# Altium schematic sheet [10] - Isolation.SchDoc
size A3
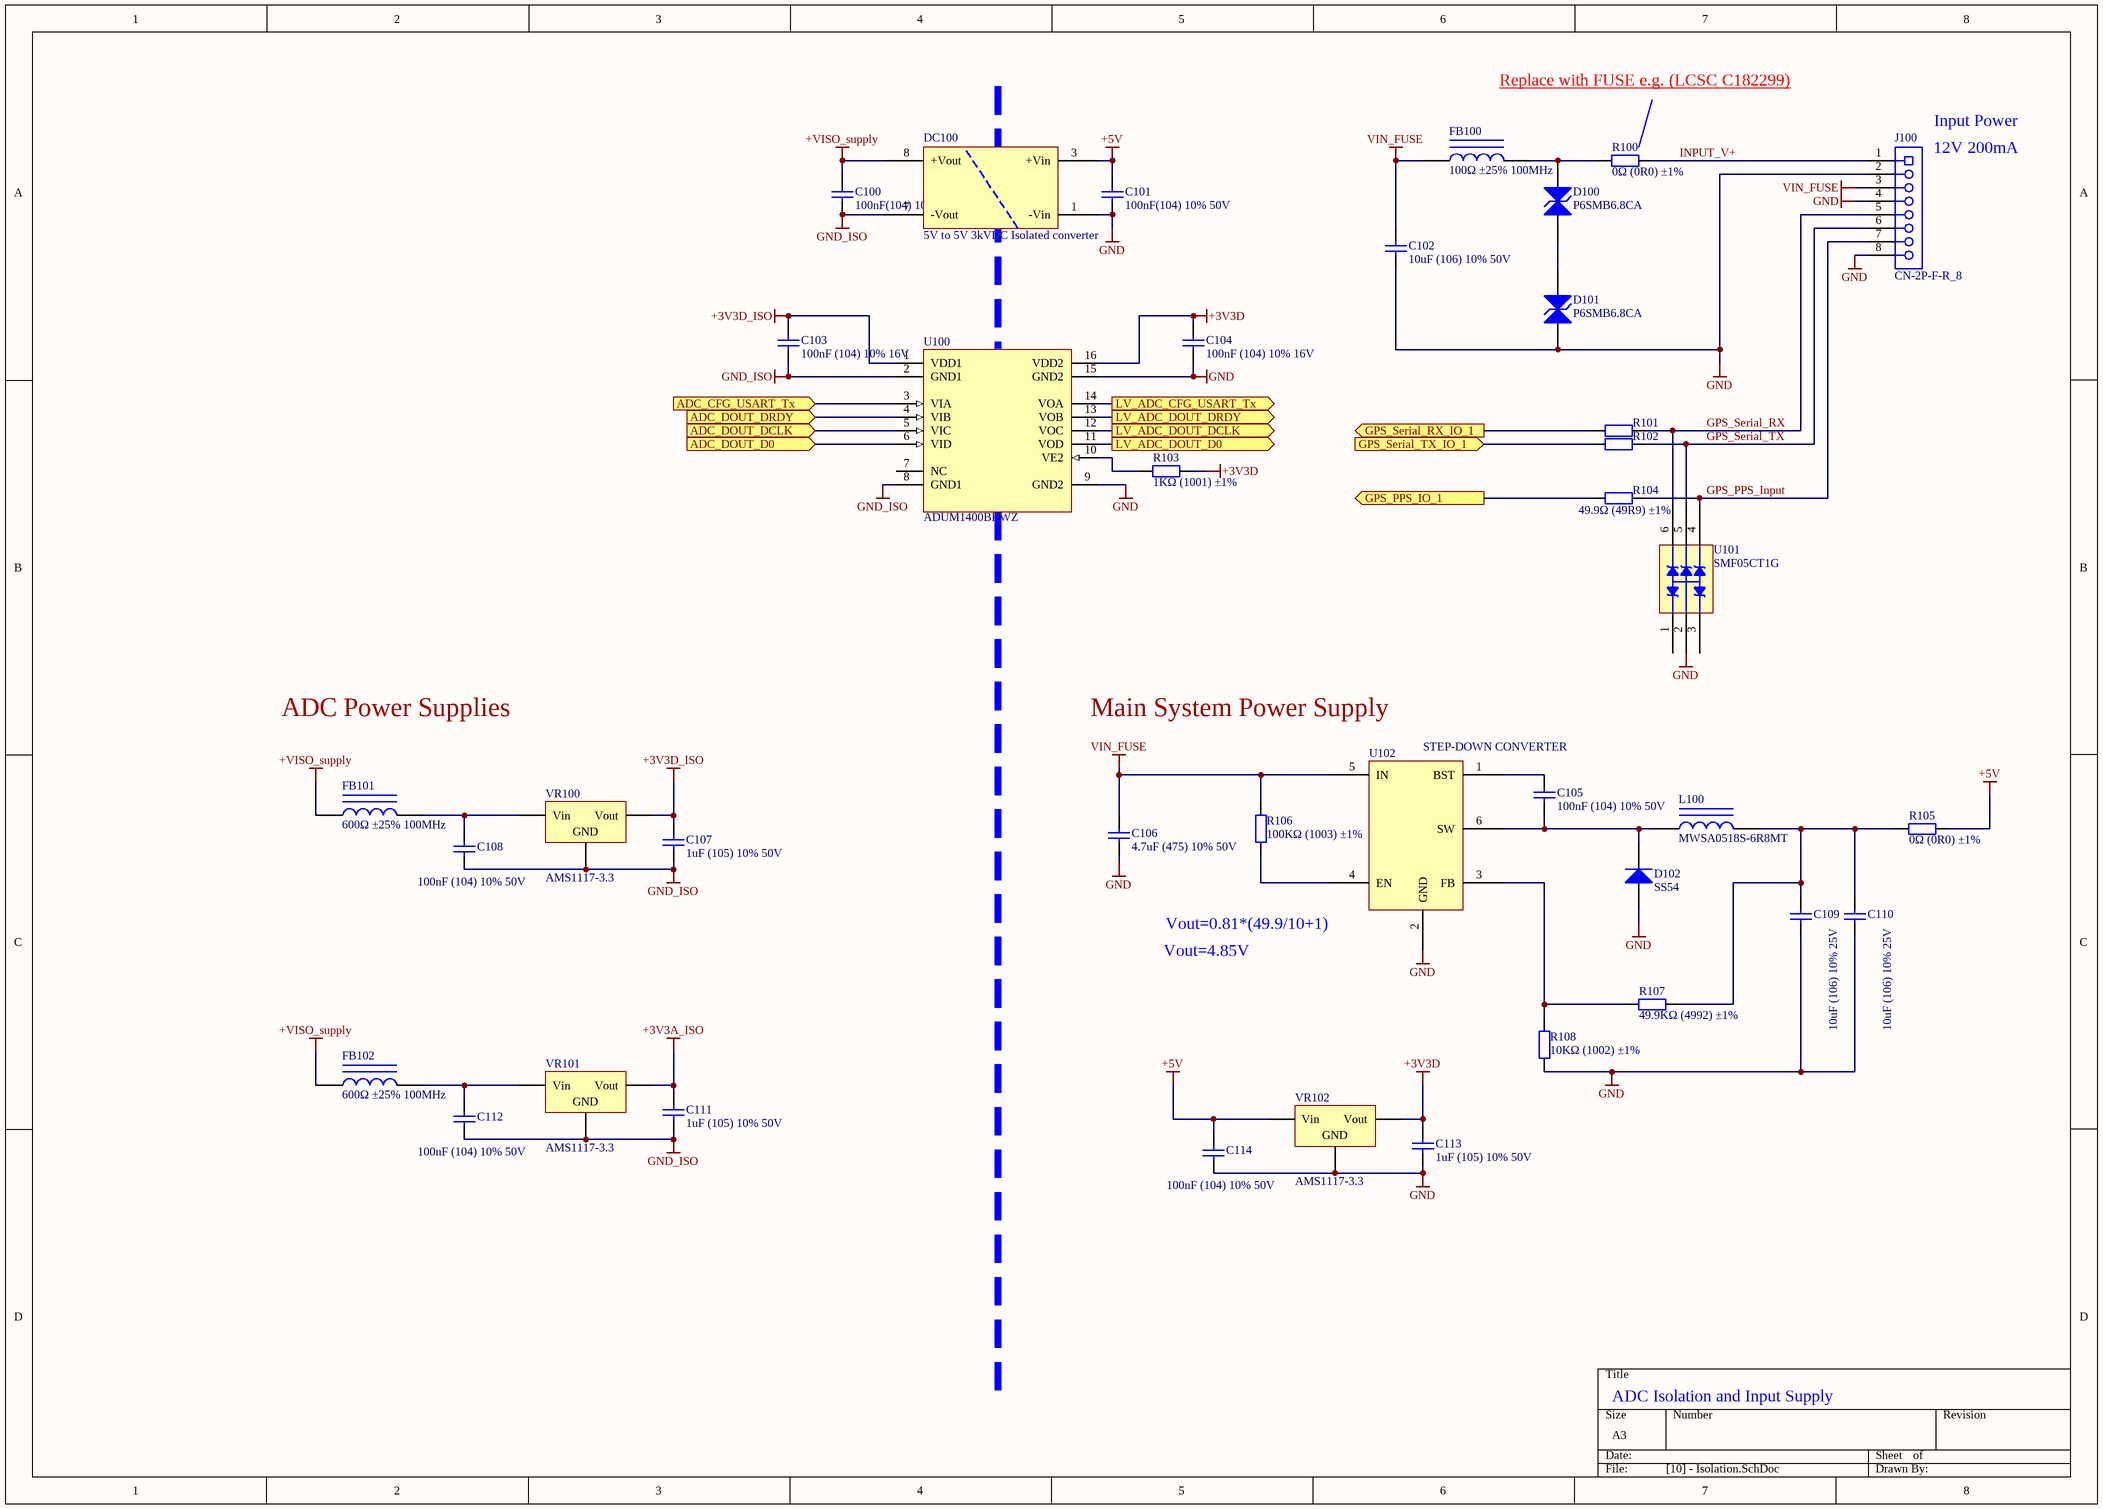
[diagram p0: [10] - Isolation.SchDoc]

## Parts
C100  100nF(104) 10% 50V  [0805_C]
C101  100nF(104) 10% 50V  [0805_C]
C102  10uF (106) 10% 50V  [1206_C]
C103  100nF (104) 10% 16V  [0402_C]
C104  100nF (104) 10% 16V  [0402_C]
C105  100nF (104) 10% 50V  [0603_C]
C106  4.7uF (475) 10% 50V  [1206_C]
C107  1uF (105) 10% 50V  [0603_C]
C108  100nF (104) 10% 50V  [0603_C]
C109  10uF (106) 10% 25V  [0805_C]
C110  10uF (106) 10% 25V  [0805_C]
C111  1uF (105) 10% 50V  [0603_C]
C112  100nF (104) 10% 50V  [0603_C]
C113  1uF (105) 10% 50V  [0603_C]
C114  100nF (104) 10% 50V  [0603_C]
D100  P6SMB6.8CA  [SMB(DO-214AA)_S1]
D101  P6SMB6.8CA  [SMB(DO-214AA)_S1]
D102  SS54  [SMA(DO-214AC)_S1]
DC100  5V to 5V 3kVDC Isolated converter  [NXE1S0505MC-R7]
FB100  100Ω ±25% 100MHz  [0805_L]
FB101  600Ω ±25% 100MHz  [0805_L]
FB102  600Ω ±25% 100MHz  [0805_L]
J100  CN-2P-F-R_8  [PHOE-8way]
L100  MWSA0518S-6R8MT  [MWSA0518]
R100  0Ω (0R0) ±1%  [0603_R]
R101  49.9Ω (49R9) ±1%  [0402_R]  (value not drawn)
R102  49.9Ω (49R9) ±1%  [0402_R]  (value not drawn)
R103  1KΩ (1001) ±1%  [0402_R]
R104  49.9Ω (49R9) ±1%  [0402_R]
R105  0Ω (0R0) ±1%  [0805_R]
R106  100KΩ (1003) ±1%  [0402_R]
R107  49.9KΩ (4992) ±1%  [0402_R]
R108  10KΩ (1002) ±1%  [0402_R]
U100  ADUM1400BRWZ  [ADI-RW-16_L]
U101  SMF05CT1G  [SC-70-6(SOT-363)]
U102  STEP-DOWN CONVERTER  [*TSOT-23_S6]
VR100  AMS1117-3.3  [SOT-223]
VR101  AMS1117-3.3  [SOT-223]
VR102  AMS1117-3.3  [SOT-223]

## Ports
ADC_CFG_USART_Tx (in), ADC_DOUT_D0 (in), ADC_DOUT_DCLK (in), ADC_DOUT_DRDY (in), GPS_PPS_IO_1 (out), GPS_Serial_RX_IO_1 (out), GPS_Serial_TX_IO_1 (in), LV_ADC_CFG_USART_Tx (out), LV_ADC_DOUT_D0 (out), LV_ADC_DOUT_DCLK (out), LV_ADC_DOUT_DRDY (out)

## Nets
+3V3A_ISO: C111.2 VR101.2(Vout)
+3V3D: C104.2 C113.2 R103.2 U100.16(VDD2) VR102.2(Vout)
+3V3D_ISO: C103.2 C107.2 U100.1(VDD1) VR100.2(Vout)
+5V: C101.2 C114.2 DC100.3(+Vin) R105.2 VR102.3(Vin)
+VISO_supply: C100.2 DC100.8(+Vout) FB101.1 FB102.1
GND: C101.1 C102.1 C104.1 C106.1 C109.1 C110.1 C113.1 C114.1 D101.1(A) D102.1(A) DC100.1(-Vin) J100.2 J100.4 J100.8 R108.2 U100.9(GND2) U100.15(GND2) U101.2 U102.2(GND) VR102.1(GND)
GND_ISO: C100.1 C103.1 C107.1 C108.1 C111.1 C112.1 DC100.7(-Vout) U100.2(GND1) U100.8(GND1) VR100.1(GND) VR101.1(GND)
VIN_FUSE: C102.2 C106.2 FB100.1 J100.3 R106.2 U102.5(IN)
ADC_CFG_USART_Tx: U100.3(VIA) ; port ADC_CFG_USART_Tx
ADC_DOUT_D0: U100.6(VID) ; port ADC_DOUT_D0
ADC_DOUT_DCLK: U100.5(VIC) ; port ADC_DOUT_DCLK
ADC_DOUT_DRDY: U100.4(VIB) ; port ADC_DOUT_DRDY
GPS_PPS_Input: J100.7 R104.2 U101.4
GPS_PPS_IO_1: R104.1 ; port GPS_PPS_IO_1
GPS_Serial_RX: J100.5 R101.2 U101.6
GPS_Serial_RX_IO_1: R101.1 ; port GPS_Serial_RX_IO_1
GPS_Serial_TX: J100.6 R102.2 U101.5
GPS_Serial_TX_IO_1: R102.1 ; port GPS_Serial_TX_IO_1
INPUT_V+: J100.1 R100.2
LV_ADC_CFG_USART_Tx: U100.14(VOA) ; port LV_ADC_CFG_USART_Tx
LV_ADC_DOUT_D0: U100.11(VOD) ; port LV_ADC_DOUT_D0
LV_ADC_DOUT_DCLK: U100.12(VOC) ; port LV_ADC_DOUT_DCLK
LV_ADC_DOUT_DRDY: U100.13(VOB) ; port LV_ADC_DOUT_DRDY
NetC105_1: C105.1 D102.2(K) L100.1 U102.6(SW)
NetC105_2: C105.2 U102.1(BST)
NetC108_2: C108.2 FB101.2 VR100.3(Vin)
NetC109_2: C109.2 C110.2 L100.2 R105.1 R107.2
NetC112_2: C112.2 FB102.2 VR101.3(Vin)
NetD100_1: D100.1(A) D101.2(K)
NetD100_2: D100.2(K) FB100.2 R100.1
NetR103_1: R103.1 U100.10(VE2)
NetR106_1: R106.1 U102.4(EN)
NetR107_1: R107.1 R108.1 U102.3(FB)

Not connected (* = marked no-connect by the designer): U100 7(NC); U101 1 3

## Notes on the sheet
- Replace with FUSE e.g. (LCSC C182299)
- (near J100) Input Power
- (near J100) 12V 200mA
- ADC Power Supplies
- (near U102) Main System Power Supply
- (near U102) Vout=0.81*(49.9/10+1)
- Vout=4.85V
- ADC Isolation and Input Supply

## Library data of the parts
C100 C101 = 0805 100nF(104) 10% 50V: 贴片电容; ComponentLink1Description: 供应商链接; ComponentLink1URL: http://www.szlcsc.com/product/details_50686.html; Package: 0805; Supplier: LC; SuppliersPartNumber: C49678
C102 = 1206 10uF (106) 10% 50V: 贴片电容; ComponentLink1Description: 供应商链接; ComponentLink1URL: http://www.szlcsc.com/product/details_14236.html; Package: 1206; Supplier: LC; SuppliersPartNumber: C13585
C103 C104 = 0402 100nF (104) 10% 16V: 贴片电容; ComponentLink1Description: 供应商链接; ComponentLink1URL: http://www.szlcsc.com/product/details_1877.html; Package: 0402; Supplier: LC; SuppliersPartNumber: C1525
C105 C108 C112 C114 = 0603 100nF (104) 10% 50V: 贴片电容; ComponentLink1Description: 供应商链接; ComponentLink1URL: http://www.szlcsc.com/product/details_15331.html; Package: 0603; Supplier: LC; SuppliersPartNumber: C14663
C106 = 1206 4.7uF (475) 10% 50V: 贴片电容; ComponentLink1Description: 供应商链接; ComponentLink1URL: http://www.szlcsc.com/product/details_30577.html; Package: 1206; Supplier: LC; SuppliersPartNumber: C29823
C107 C111 C113 = 0603 1uF (105) 10% 50V: 贴片电容; ComponentLink1Description: 供应商链接; ComponentLink1URL: http://www.szlcsc.com/product/details_16531.html; Package: 0603; Supplier: LC; SuppliersPartNumber: C15849
C109 C110 = 0805 10uF (106) 10% 25V: 贴片电容; ComponentLink1Description: 供应商链接; ComponentLink1URL: http://www.szlcsc.com/product/details_16532.html; Package: 0805; Supplier: LC; SuppliersPartNumber: C15850
D100 D101 = SMB/DO-214AA P6SMB6.8CA: TVS; ComponentLink1Description: 供应商链接; ComponentLink1URL: http://www.szlcsc.com/product/details_79530.html; Package: SMB/DO-214AA; Supplier: LC; SuppliersPartNumber: C78395
D102 = SMA(DO-214AC) SS54: 二极管; ComponentLink1Description: 供应商链接; ComponentLink1URL: http://www.szlcsc.com/product/details_23178.html; Package: SMA(DO-214AC); Supplier: LC; SuppliersPartNumber: C22452
DC100 = NXE1S0505MC-R7: NXE1 1W Isolated DC-DC Converter Surface Mount, Voltage in 4.5 → 5.5 V dc; JLCPCB: NO
FB100 = 0805 100Ω 25% 100MHz: 贴片磁珠; ComponentLink1Description: 供应商链接; ComponentLink1URL: http://www.szlcsc.com/product/details_1367.html; Package: 0805; Supplier: LC; SuppliersPartNumber: C1015
FB101 FB102 = 0805 600Ω 25% 100MHz: 贴片磁珠; ComponentLink1Description: 供应商链接; ComponentLink1URL: http://www.szlcsc.com/product/details_1369.html; Package: 0805; Supplier: LC; SuppliersPartNumber: C1017
J100 = CN-2P-F-R_8: 8way - 5.08 block; JLCPCB: NO
L100 = MWSA0518S-6R8MT: POWER INDUCTORS SMD,5.2X5.4X1.8MM ROHS; Value: 6.8uH; Current Rating: 5.0A; Package: 5.2X5.4X1.8MM; Supplier: LC; SuppliersPartNumber: C408348; ClassName: PowerPads
R100 = 0603 0Ω (0R0) 1%: 贴片电阻; ComponentLink1Description: 供应商链接; ComponentLink1URL: http://www.szlcsc.com/product/details_21903.html; Package: 0603; Supplier: LC; SuppliersPartNumber: C21189
R101 R102 R104 = 0402 49.9Ω (49R9) 1%: 贴片电阻; ComponentLink1Description: 供应商链接; ComponentLink1URL: http://www.szlcsc.com/product/details_25863.html; Package: 0402; Supplier: LC; SuppliersPartNumber: C25120
R103 = 0402 1KΩ (1001) 1%: 贴片电阻; ComponentLink1Description: 供应商链接; ComponentLink1URL: http://www.szlcsc.com/product/details_12256.html; Package: 0402; Supplier: LC; SuppliersPartNumber: C11702
R105 = 0805 0Ω (0R0) 1%: 贴片电阻; ComponentLink1Description: 供应商链接; ComponentLink1URL: http://www.szlcsc.com/product/details_18165.html; Package: 0805; Supplier: LC; SuppliersPartNumber: C17477
R106 = 0402 100KΩ (1003) 1%: 贴片电阻; ComponentLink1Description: 供应商链接; ComponentLink1URL: http://www.szlcsc.com/product/details_26484.html; Package: 0402; Supplier: LC; SuppliersPartNumber: C25741
R107 = 0402 49.9KΩ (4992) 1%: 贴片电阻; ComponentLink1Description: 供应商链接; ComponentLink1URL: http://www.szlcsc.com/product/details_26640.html; Package: 0402; Supplier: LC; SuppliersPartNumber: C25897
R108 = 0402 10KΩ (1002) 1%: 贴片电阻; ComponentLink1Description: 供应商链接; ComponentLink1URL: http://www.szlcsc.com/product/details_26487.html; Package: 0402; Supplier: LC; SuppliersPartNumber: C25744
U100 = ADI-ADUMX400-RX-16: Quad Channel Digital Isolator, 2.5 KV rms Insulation Rating, 10 Mbps Data Rate, 50 ns Delay, Industrial, 16-pin SOIC (RW-16), Tube; Manufacturer: Analog Devices; Max Data Rate: 10Mbps; Insulation Rating (kVrms): 2.5; Mounting Technology: Surface Mount; ComponentLink5Description: URL Link2; PackageReference: RW-16; ComponentLink3Description: Package Specification; Code_JEDEC: MS-013-AA; PartNumber: ADUM1400BRWZ; DatasheetVersion: Rev. H; ComponentLink2Description: Datasheet; ComponentLink4Description: URL Link1; ComponentLink1URL: http://www.analog.com/en/index.html; PackageVersion: 032707-B, 03/2007; Max Operating Temp (degreesC): 125; PackageDescription: 16-Pin Standard Small Outline Package, Body 10.3 x 7.5 mm, Pitch 1.27 mm; ComponentLink1Description: Manufacturer URL; ComponentLink5URL: Reference Circuit:http://www.analog.com/en/interface-isolation/digital-isolators/adum1400/products/product.html#product-recommendations; ComponentLink2URL: http://www.analog.com/static/imported-files/data_sheets/ADuM1400_1401_1402.pdf; ComponentLink4URL: Product URL:http://www.analog.com/en/interface-isolation/digital-isolators/adum1400/products/product.html; ComponentLink3URL: http://www.analog.com/static/imported-files/packages/PKG_PDF/SOIC_WIDE%20%28RW%29/RW_16.pdf; SuppliersPartNumber: C72910
U101 = SMF05CT1G_[C15879]: TVS; ComponentLink1Description: 供应商链接; ComponentLink1URL: http://www.szlcsc.com/product/details_16561.html; Package: SC-70-6(SOT-363); Supplier: LC; SuppliersPartNumber: C15879
U102 = MP2359: 1.2A, 24V, 1.4MHz STEP-DOWN CONVERTER IN A TSOT23-6; SuppliersPartNumber: C14259; ClassName: PowerPads
VR100-VR102 = SOT-223 AMS1117-3.3: 低压差线性稳压(LDO); ComponentLink1Description: 供应商链接; ComponentLink1URL: http://www.szlcsc.com/product/details_6652.html; Package: SOT-223; Supplier: LC; SuppliersPartNumber: C6186